# EAGLE schematic prepcb (EAGLE 9.6.2)
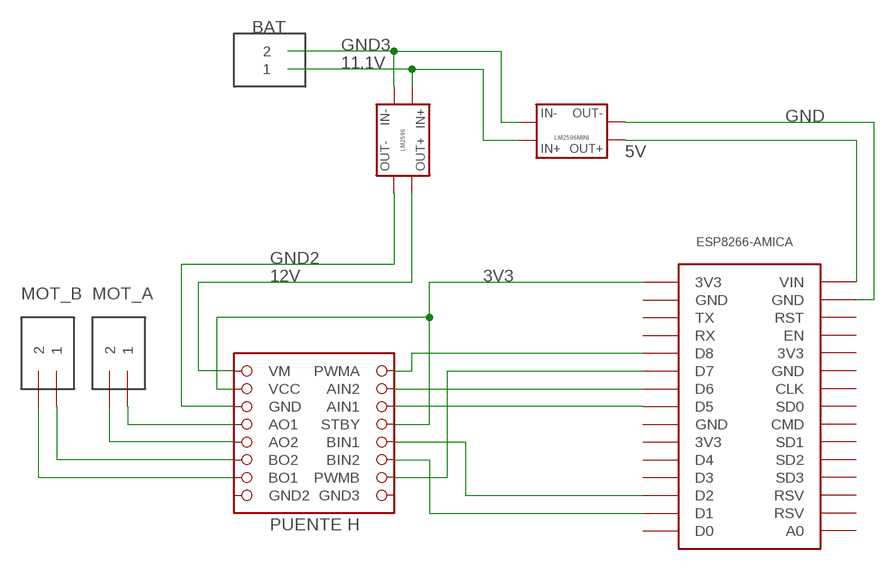
[diagram p0: schematic, sheet 1]

## Parts
ARMA1  TERMINAL_2P  [KF301-2P]
ARMA2  TERMINAL_2P  [KF301-2P]
ARMA3  TERMINAL_2P  [KF301-2P]
ESP8266-AMICA  NODEMCU_ESP8266  [NODEMCU_ESP8266]
U$1  BB-LM2596  [BB-LM2596]
U$2  BB-TB6612  [BB-TB6612]
U$3  BB-LM2596MINILM2596MINIV2  [LM2596MINIV2]

## Nets
3V3: ESP8266-AMICA.3V3@1(3V3) U$2.STBY U$2.VCC
5V: ESP8266-AMICA.VIN U$3.OUT+
11.1V: ARMA3.1 U$1.IN+ U$3.IN+
12V: U$1.OUT+ U$2.VM
GND: ESP8266-AMICA.GND@4(GND) U$3.OUT-
GND2: U$1.OUT- U$2.GND
GND3: ARMA3.2 U$1.IN- U$3.IN-
N$4: ESP8266-AMICA.D8 U$2.PWMA
N$5: ESP8266-AMICA.D7 U$2.PWMB
N$6: ARMA2.1 U$2.BO2
N$7: ESP8266-AMICA.D6 U$2.AI2(AIN2)
N$8: ESP8266-AMICA.D5 U$2.AI1(AIN1)
N$9: ESP8266-AMICA.D2 U$2.BI1(BIN1)
N$10: ESP8266-AMICA.D1 U$2.BI2(BIN2)
N$13: ARMA1.2 U$2.AO2
N$14: ARMA1.1 U$2.AO1
N$15: ARMA2.2 U$2.BO1
Unconnected: ESP8266-AMICA.A0 ESP8266-AMICA.CLK ESP8266-AMICA.CMD ESP8266-AMICA.D0 ESP8266-AMICA.D3 ESP8266-AMICA.D4 ESP8266-AMICA.EN ESP8266-AMICA.RST ESP8266-AMICA.RSV1(RSV) ESP8266-AMICA.RSV2(RSV) ESP8266-AMICA.RX ESP8266-AMICA.SD1 ESP8266-AMICA.SD2 ESP8266-AMICA.SD3 ESP8266-AMICA.SDO(SD0) ESP8266-AMICA.TX U$2.GND2 U$2.GND3

## Notes on the sheet
- BAT
- MOT_B | MOT_A
- PUENTE H

## Power pins joined to a net without a drawn wire
3V3: ESP8266-AMICA.3V3@2(3V3) ESP8266-AMICA.3V3@3(3V3)
GND: ESP8266-AMICA.GND@1(GND) ESP8266-AMICA.GND@2(GND) ESP8266-AMICA.GND@3(GND)

## Library data of the parts
ARMA1-ARMA3 = KF301-2P-Terminal:TERMINAL_2P: Terminal Screw 2 Port 5mm Pitch
ESP8266-AMICA = nodemcu_esp8266:NODEMCU_ESP8266: Node MCU V2 (ESP8266) Created by Harish
U$1 = my-library:BB-LM2596
U$2 = my-library:BB-TB6612
U$3 = my-library:BB-LM2596MINI